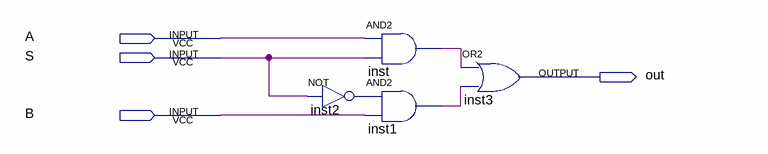
[diagram p0: schematic sheet]
// Quartus schematic mux21.bdf as structural Verilog: 4 symbols, 4 pins
module mux21 (
  input  A,
  input  S,
  input  B,
  output out
);

  wire inst1_out, inst2_out, inst_out;

  not inst2 (inst2_out, S);
  and inst (inst_out, A, S);
  and inst1 (inst1_out, inst2_out, B);
  or inst3 (out, inst_out, inst1_out);
endmodule
